# Altium schematic sheet head(mehdi).SchDoc
size A2
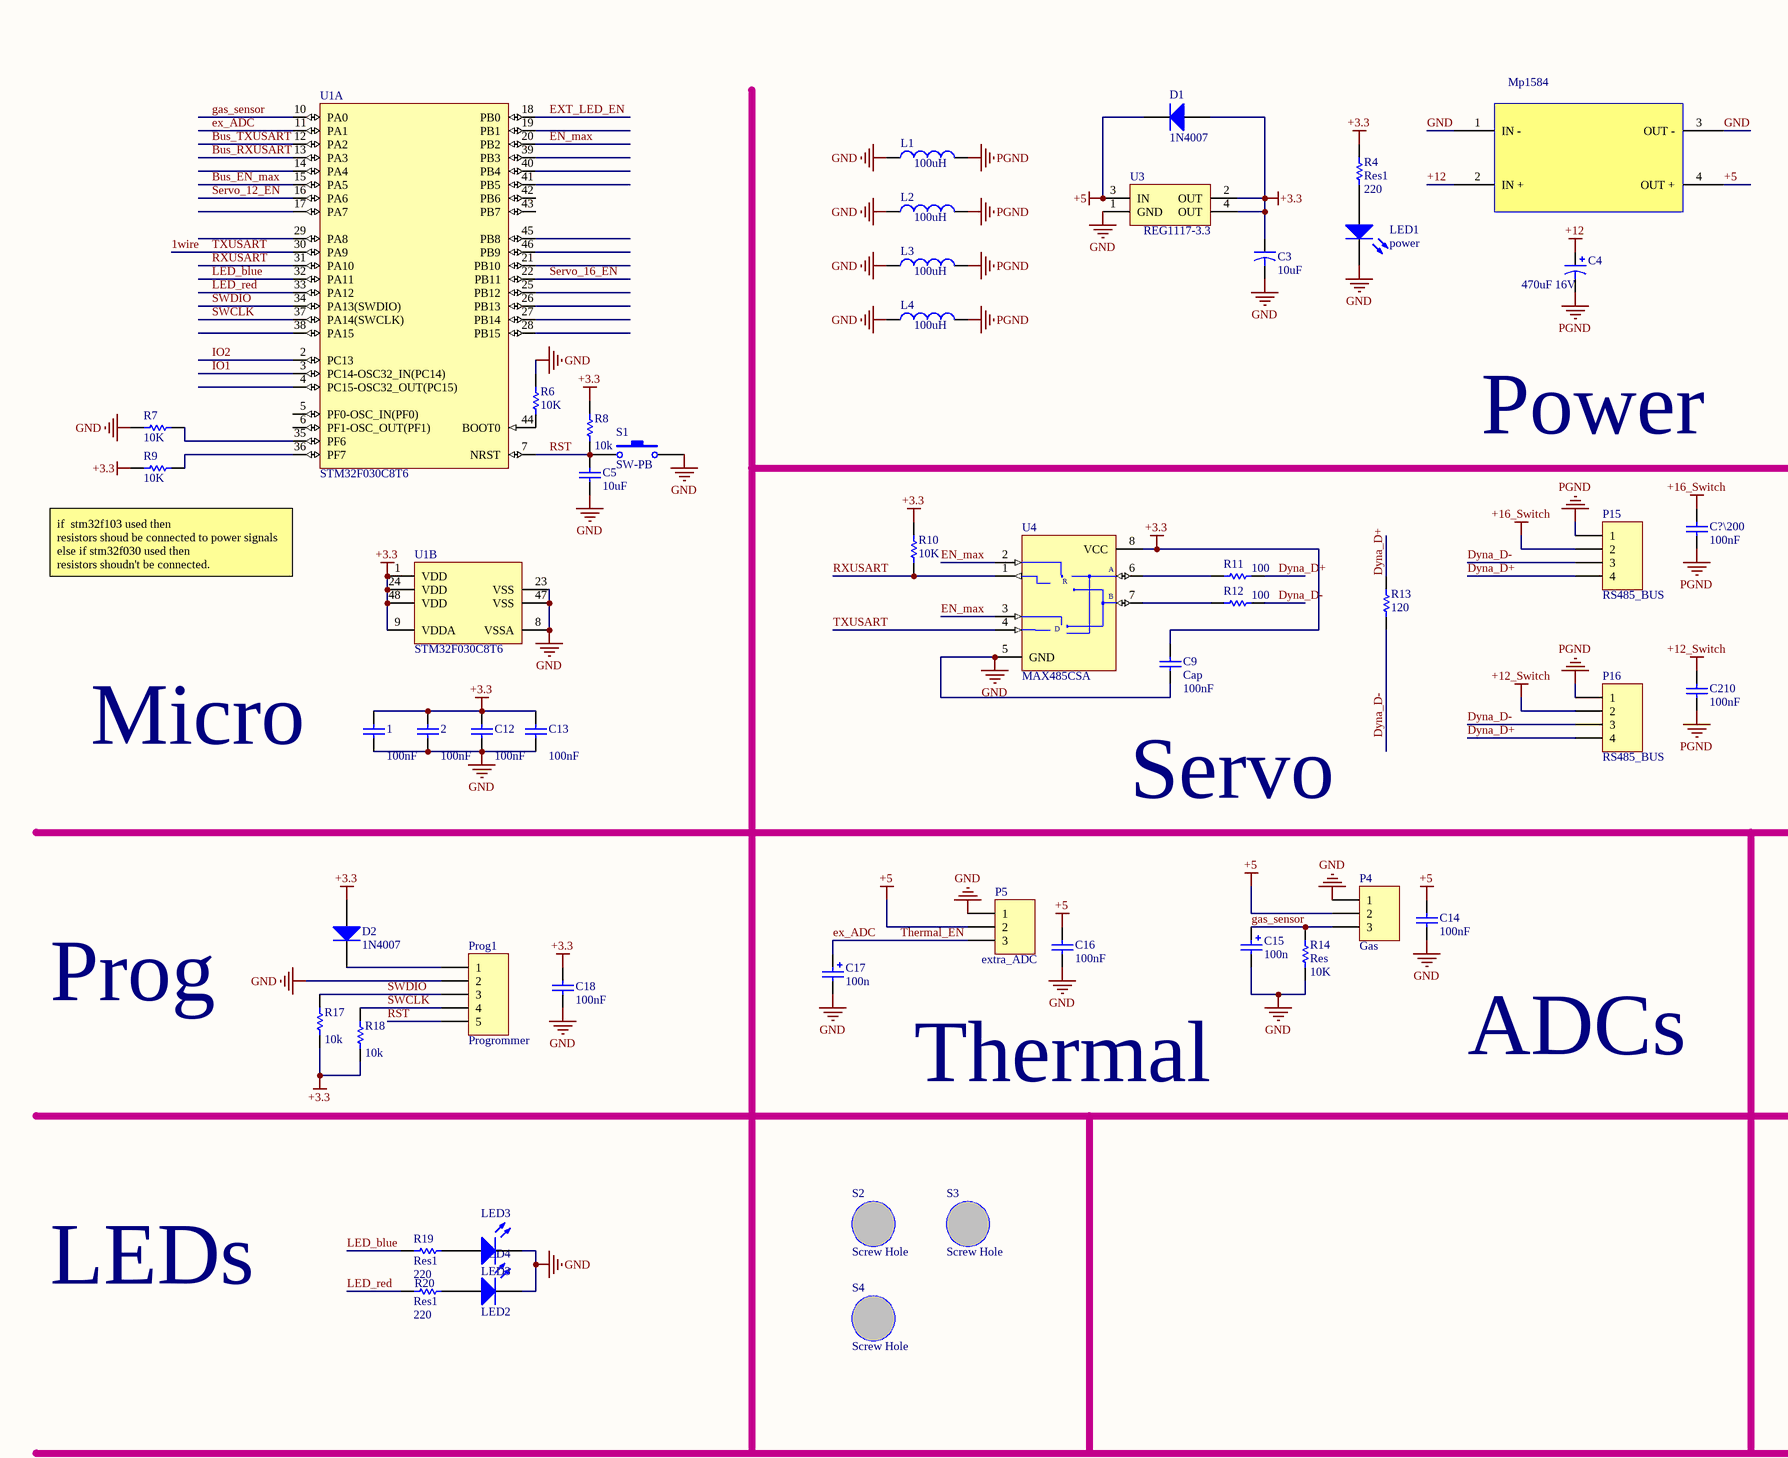
[diagram p0: head(mehdi).SchDoc, left]
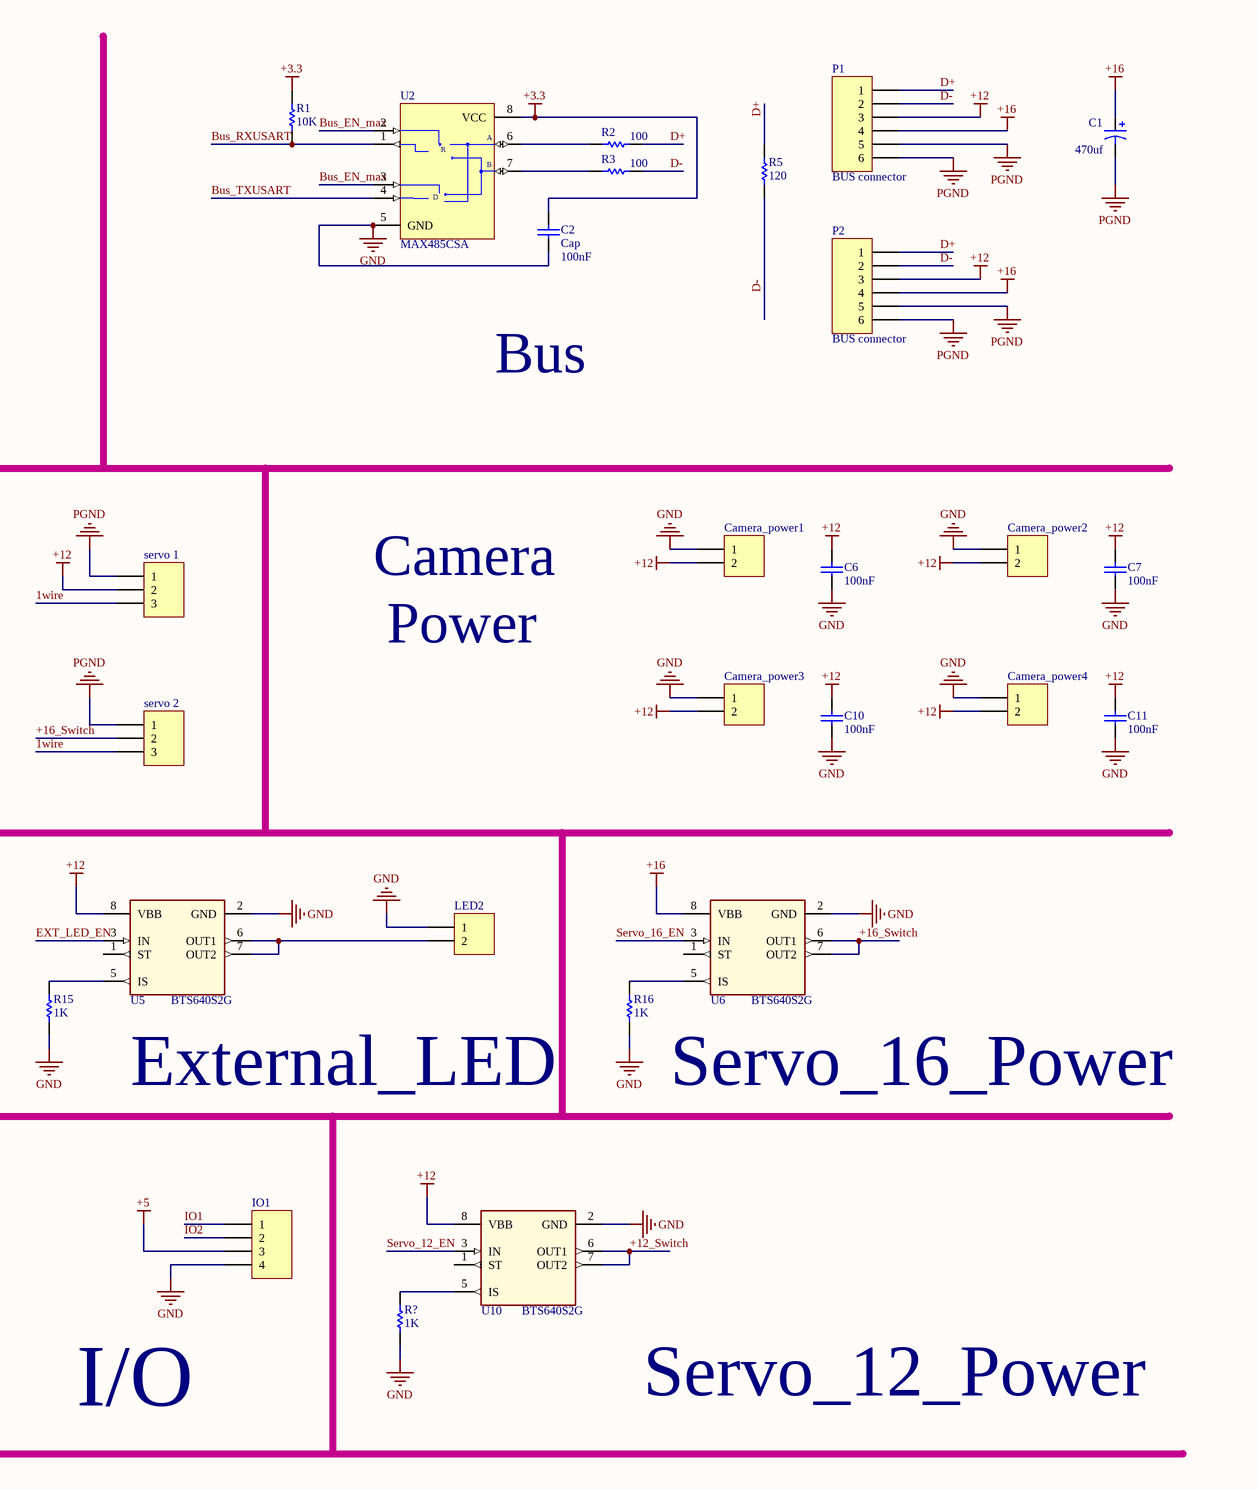
[diagram p1: head(mehdi).SchDoc, right]

## Parts
1  value 100nF  [j1-0603]
2  value 100nF  [j1-0603]
C1  value 470uf  [CAP 470uf sleep smd]  (hidden comment: Cap Pol1)
C2  Cap  value 100nF  [j1-0603]
C3  value 10uF  [0805]  (hidden comment: Cap_El)
C4  value 470uF 16V  [CAP 470uf sleep smd]  (hidden comment: Cap Pol1)
C5  10uF  [2012[0805]]
C6  100nF  [J1-0603]
C7  100nF  [J1-0603]
C9  Cap  value 100nF  [j1-0603]
C10  100nF  [J1-0603]
C11  100nF  [J1-0603]
C12  value 100nF  [j1-0603]
C13  value 100nF  [j1-0603]
C14  100nF  [J1-0603]
C15  value 100n  [j1-0603]
C16  100nF  [J1-0603]
C17  value 100n  [j1-0603]
C18  value 100nF  [j1-0603]
C210  100nF  [J1-0603]
C?\200  100nF  [J1-0603]
Camera_power1  Header 2  [jp circular 2]  (value not drawn)
Camera_power2  Header 2  [jp circular 2]  (value not drawn)
Camera_power3  Header 2  [jp circular 2]  (value not drawn)
Camera_power4  Header 2  [jp circular 2]  (value not drawn)
D1  1N4007  [US1M]
D2  1N4007  [US1M]
IO1  (no value)  [HDR1X4]
L1  value 100uH  [2012[0805]]
L2  value 100uH  [2012[0805]]
L3  value 100uH  [2012[0805]]
L4  value 100uH  [2012[0805]]
LED1  power  [3518]
LED2  (no value)  [jp circular 2]
LED3  LED3  [3518]
LED4  LED2  [3518]
Mp1  Mp1584  [mp1584-1.8]
P1  BUS connector  [CON6-TIWAN]
P2  BUS connector  [con6-tiwan]
P4  Gas  [jp circular 3]
P5  extra_ADC  [jp circular 3]
P15  RS485_BUS  [jp circular 4]
P16  RS485_BUS  [jp circular 4]
Prog1  Progrommer  [HDR1x5]
R1  value 10K  [j1-0603]  (hidden comment: Res1)
R2  value 100  [j1-0603]  (hidden comment: Res1)
R3  value 100  [j1-0603]  (hidden comment: Res1)
R4  Res1  value 220  [j1-0603]
R5  value 120  [j1-0603]  (hidden comment: Res1)
R6  10K  [J1-0603]
R7  10K  [J1-0603]
R8  value 10k  [J1-0603]
R9  10K  [J1-0603]
R10  value 10K  [j1-0603]  (hidden comment: Res1)
R11  value 100  [j1-0603]  (hidden comment: Res1)
R12  value 100  [j1-0603]  (hidden comment: Res1)
R13  value 120  [j1-0603]  (hidden comment: Res1)
R14  Res  value 10K  [j1-0603]
R15  value 1K  [j1-0603]  (hidden comment: Res1)
R16  value 1K  [j1-0603]  (hidden comment: Res1)
R17  value 10k  [J1-0603]
R18  value 10k  [J1-0603]
R19  Res1  value 220  [j1-0603]
R20  Res1  value 220  [j1-0603]
R?  value 1K  [j1-0603]  (hidden comment: Res1)
S1  SW-PB  [sw-pb-4p]
S2  Screw Hole  [Screw Holw 3-6 mm]
S3  Screw Hole  [Screw Holw 3-6 mm]
S4  Screw Hole  [Screw Holw 3-6 mm]
servo_1  (no value)  [jp circular 3]
servo_2  (no value)  [jp circular 3]
U1  STM32F030C8T6  [STM-LQFP48_N]  (parts A,B of 2)
U2  MAX485CSA  [NSO8_N]
U3  REG1117-3.3  [SOT223]
U4  MAX485CSA  [NSO8_N]
U5  BTS640S2G  [TO127P1490X440-8_7N]
U6  BTS640S2G  [TO127P1490X440-8_7N]
U10  BTS640S2G  [TO127P1490X440-8_7N]

## Nets
+3.3: 1.2 2.2 C2.2 C3.1 C9.2 C12.2 C13.2 C18.2 D1.1(A) D2.1(A) R1.1 R4.1 R8.1 R9.1 R10.1 R17.2 R18.2 U1.1(VDD) U1.9(VDDA) U1.24(VDD) U1.48(VDD) U2.8(VCC) U3.2(OUT) U3.4(OUT) U4.8(VCC)
+5: C14.2 C16.2 D1.2(K) IO1.3 Mp1.4(OUT_+) P4.2 P5.2 U3.3(IN)
+12: C4.1 C6.2 C7.2 C10.2 C11.2 Camera_power1.2 Camera_power2.2 Camera_power3.2 Camera_power4.2 Mp1.2(IN_+) P1.3 P2.3 servo_1.2 U5.8(VBB) U10.8(VBB)
+12_Switch: C210.2 P16.2 U10.6(OUT1) U10.7(OUT2)
+16: C1.1 P1.4 P2.4 U6.8(VBB)
+16_Switch: C?\200.2 P15.2 servo_2.2 U6.6(OUT1) U6.7(OUT2)
GND: 1.1 2.1 C2.1 C3.2 C5.2 C6.1 C7.1 C9.1 C10.1 C11.1 C12.1 C13.1 C14.1 C15.2 C16.1 C17.2 C18.1 Camera_power1.1 Camera_power2.1 Camera_power3.1 Camera_power4.1 IO1.4 L1.1 L2.1 L3.1 L4.1 LED1.2(K) LED2.1 LED3.2(K) LED4.2(K) Mp1.1(IN_-) Mp1.3(OUT_-) P4.1 P5.1 Prog1.2 R6.2 R7.2 R14.1 R15.1 R16.1 R?.1 S1.2 U1.8(VSSA) U1.23(VSS) U1.47(VSS) U2.5(GND) U3.1(GND) U4.5(GND) U5.2(GND) U6.2(GND) U10.2(GND)
PGND: C1.2 C4.2 C210.1 C?\200.1 L1.2 L2.2 L3.2 L4.2 P1.5 P1.6 P2.5 P2.6 P15.1 P16.1 servo_1.1 servo_2.1
1wire: servo_1.3 servo_2.3 U1.30(PA9) U4.4(DI)  [also labelled TXUSART]
Bus_EN_max: U1.15(PA5) U2.2(~{RE}) U2.3(DE)
Bus_RXUSART: R1.2 U1.13(PA3) U2.1(RO)
Bus_TXUSART: U1.12(PA2) U2.4(DI)
D+: P1.1 P2.1 R2.2 R5.1
D-: P1.2 P2.2 R3.2 R5.2
Dyna_D+: P15.4 P16.4 R11.2 R13.1
Dyna_D-: P15.3 P16.3 R12.2 R13.2
EN_max: U1.20(PB2) U4.2(~{RE}) U4.3(DE)
ex_ADC: C17.1 P5.3 U1.11(PA1)  [also labelled Thermal_EN]
EXT_LED_EN: U1.18(PB0) U5.3(IN)
gas_sensor: C15.1 P4.3 R14.2 U1.10(PA0)
IO1: IO1.1 U1.3(PC14-OSC32_IN(PC14))
IO2: IO1.2 U1.2(PC13)
LED_blue: R19.1 U1.32(PA11)
LED_red: R20.1 U1.33(PA12)
RST: C5.1 Prog1.5 R8.2 S1.1 U1.7(NRST)
RXUSART: R10.2 U1.31(PA10) U4.1(RO)
Servo_12_EN: U1.16(PA6) U10.3(IN)
Servo_16_EN: U1.22(PB11) U6.3(IN)
SWCLK: Prog1.4 R18.1 U1.37(PA14(SWCLK))
SWDIO: Prog1.3 R17.1 U1.34(PA13(SWDIO))
NetD2_2: D2.2(K) Prog1.1
NetLED1_1: LED1.1(A) R4.2
NetLED2_2: LED2.2 U5.6(OUT1) U5.7(OUT2)
NetLED3_1: LED3.1(A) R19.2
NetLED4_1: LED4.1(A) R20.2
NetR2_1: R2.1 U2.6(A)
NetR3_1: R3.1 U2.7(B)
NetR6_1: R6.1 U1.44(BOOT0)
NetR7_1: R7.1 U1.35(PF6)
NetR9_2: R9.2 U1.36(PF7)
NetR11_1: R11.1 U4.6(A)
NetR12_1: R12.1 U4.7(B)
NetR15_2: R15.2 U5.5(IS)
NetR16_2: R16.2 U6.5(IS)
NetR?_2: R?.2 U10.5(IS)

Not connected (* = marked no-connect by the designer): U1 4(PC15-OSC32_OUT(PC15)) 5(PF0-OSC_IN(PF0)) 6(PF1-OSC_OUT(PF1)) 14(PA4) 17(PA7) 19(PB1) 21(PB10) 25(PB12) 26(PB13) 27(PB14) 28(PB15) 29(PA8) 38(PA15) 39(PB3) 40(PB4) 41(PB5) 42(PB6) 43(PB7) 45(PB8) 46(PB9); U5 1(ST); U6 1(ST); U10 1(ST)

## Notes on the sheet
- Bus
- Power
- if  stm32f103 used then
  resistors shoud be connected to power signals
  else if stm32f030 used then
  resistors shoudn't be connected.
- Camera
- Micro
- Servo
- Prog
- Thermal
- ADCs
- External_LED
- Servo_16_Power
- LEDs
- I/O
- Servo_12_Power
- (in symbol MAX485CSA) R; D

## Library data of the parts
1 2 C12 C13 C18 = Cap: Capacitor; Manufacturer: Generic Components; Class: Passive; Published: 08/06/2000; Publisher: Altium Hobart Technology Centre; SubClass: Capacitor
C1 = Cap Pol1: Polarized Capacitor (Radial); Published: 8-Jun-2000; LatestRevisionDate: 17-Jul-2002; LatestRevisionNote: Re-released for DXP Platform.; PackageReference: RB7.6-15; Publisher: Altium Limited
C2 C6 C7 C9-C11 C14 C16 C210 C?\200 = Cap: Capacitor; Published: 8-Jun-2000; LatestRevisionDate: 17-Jul-2002; LatestRevisionNote: Re-released for DXP Platform.; PackageReference: RAD-0.3; Publisher: Altium Limited
  C6 C7 C10 C11 C14 C16 C210 C?\200: Value: 100nF
C3 = Cap_El: Capacitor; Published: 23-Sep-2002; PackageReference: CAPR5-4X5; Publisher: Altium Limited
C4 = Cap Pol1: Polarized Capacitor (Radial); pin to pad: 1>2 2>1; Published: 8-Jun-2000; LatestRevisionDate: 17-Jul-2002; LatestRevisionNote: Re-released for DXP Platform.; PackageReference: RB7.6-15; Publisher: Altium Limited
C5 = Cap: Capacitor; Value: 100nF; Published: 8-Jun-2000; LatestRevisionDate: 17-Jul-2002; LatestRevisionNote: Re-released for DXP Platform.; PackageReference: RAD-0.3; Publisher: Altium Limited
C15 C17 = Cap Pol1: Polarized Capacitor (Radial); Manufacturer: Generic Components; Class: Passive; Published: 08/06/2000; Publisher: Altium Hobart Technology Centre; SubClass: Capacitor
Camera_power1-Camera_power4 LED2 = Header 2: Header, 2-Pin; Publisher: Altium Limited
  Camera_power1-Camera_power4: Revision: 17-Jul-2002: Re-released for DXP Platform.
  LED2: LatestRevisionDate: 17-Jul-2002; LatestRevisionNote: Re-released for DXP Platform.
D1 D2 = Diode: 1 Amp General Purpose Rectifier; Revision 1: 11-Jul-2000: SIM Model Added.; Revision 2: 17-Jul-2002: Re-released for DXP Platform.; Package Information: Latest Revision: Aug-1999; Code - JEDEC: DO-204-AL; Published: 8-Jun-2000; Datasheet: Latest Revision: 1998; Package Reference: DO-41; Publisher: Altium Limited
IO1 P15 P16 = Header 4: Header, 4-Pin; LatestRevisionDate: 17-Jul-2002; LatestRevisionNote: Re-released for DXP Platform.; Publisher: Altium Limited
L1-L4 = Inductor: Manufacturer: Generic Components; Class: Passive; Published: 08/06/2000; Publisher: Altium Hobart Technology Centre; SubClass: Inductor
LED1 LED3 LED4 = LED3: Typical BLUE SiC LED; pin to pad: 1>2 2>1; Published: 8-Jun-2000; LatestRevisionDate: 17-Dec-2003; LatestRevisionNote: PCB Footprint replaced.; DatasheetDocument: 16-Apr-2002; PackageDocument: 16-Apr-2002; PackageReference: 3.5X2.8X1.9; Publisher: Altium Limited
P1 P2 = Header 6: Header, 6-Pin; LatestRevisionDate: 17-Jul-2002; LatestRevisionNote: Re-released for DXP Platform.; Publisher: Altium Limited
P4 P5 servo_1 servo_2 = Header 3: Header, 3-Pin; LatestRevisionDate: 17-Jul-2002; LatestRevisionNote: Re-released for DXP Platform.; Publisher: Altium Limited
Prog1 = Header 5: Header, 5-Pin; LatestRevisionDate: 17-Jul-2002; LatestRevisionNote: Re-released for DXP Platform.; Publisher: Altium Limited
R1-R5 R10-R13 R15 R16 R19 R20 R? = Res1: Resistor; Published: 8-Jun-2000; LatestRevisionDate: 17-Jul-2002; LatestRevisionNote: Re-released for DXP Platform.; PackageReference: AXIAL-0.3; Publisher: Altium Limited
R6 R7 R9 = Res1: Resistor; Value: 1K; Published: 8-Jun-2000; LatestRevisionDate: 17-Jul-2002; LatestRevisionNote: Re-released for DXP Platform.; PackageReference: AXIAL-0.3; Publisher: Altium Limited
R8 R14 R17 R18 = Res: Semiconductor Resistor; Published: 8-Jun-2000; LatestRevisionDate: 17-Jul-2002; LatestRevisionNote: Re-released for DXP Platform.; PackageReference: AXIAL-0.5; Publisher: Altium Limited
S1 = SW-PB: Switch; Published: 24-Mar-1999; LatestRevisionDate: 17-Jul-2002; LatestRevisionNote: Re-released for DXP Platform.; PackageReference: SPST-2; Publisher: Altium Limited
U1 = STM32F030C8T6: ARM Cortex-M0 32-bit MCU, 64 KB Flash, 8 KB Internal RAM, 39 I/Os, 48-pin LQFP, -40 to 85 degC, Tray; FLASH Size (Prog) (kB): 64; I/Os (High Current): 39; Internal RAM Size (kB): 8; Operating Frequency(F) (Processor speed) (MHz): 48; Supply Voltage(Vcc) min (V): 2.4; DatasheetVersion: Rev. 1; PackageVersion: Rev. 6, 06/2013; PackageReference: LQFP48; PackageDescription: 48-Pin Low Profile Quad Flat Package, 7 x 7 mm Body, 0.5 mm Pitch; Supplier 1: Digi-Key; Supplier Part Number 1: 497-14043-ND; Supplier 2: Newark; Supplier Part Number 2: 06X3647; Supplier 3: Mouser; Supplier Part Number 3: 511-STM32F030C8T6; Core: ARM Cortex-M0; Packing: Tray; Mounting Technology: Surface Mount; PartNumber: STM32F030C8T6; ComponentLink1Description: Manufacturer URL; ComponentLink1URL: http://www.st.com/web/en/home.html; ComponentLink2Description: Datasheet; ComponentLink2URL: http://www.st.com/st-web-ui/static/active/en/resource/technical/document/datasheet/DM00088500.pdf; ComponentLink3Description: Package Specification; ComponentLink3URL: http://www.st.com/st-web-ui/static/active/en/resource/technical/document/datasheet/DM00058181.pdf
U2 U4 = MAX485CSA: Low-Power, Slew-Rate-Limited RS-485/RS-422 Transceiver; Published: 16-Jan-2001; LatestRevisionDate: 13-Apr-2006; LatestRevisionNote: IPC-7351 Footprint Added.; DatasheetVersion: Feb-1996; PackageReference: NSO8; Publisher: Altium Limited; PackageDescription: 8-Pin Small Outline Integrated Circuit 1.27 mm Pitch; Code_JEDEC: MS-012-AA; Code_IPC: SOIC127P600-8; ComponentLink1Description: Manufacturer Link; ComponentLink1URL: http://www.maxim-ic.com/; ComponentLink2Description: Datasheet; ComponentLink2URL: http://pdfserv.maxim-ic.com/en/ds/MAX1487-MAX491.pdf
U3 = REG1117-3.3: 800mA and 1A Low Dropout Positive Regulator 2.85V, 3.3V, 5V, and Adjustable; Published: 8-Jun-2000; LatestRevisionDate: 17-Jul-2002; LatestRevisionNote: Re-released for DXP Platform.; DatasheetVersion: Sep-1997; PackageVersion: revC; PackageReference: ZZ311; Publisher: Altium Limited; PackageDescription: SOT-223/SC-73; 4 Leads; Body 6.7 x 7.3 mm, inc. leads (LxW max); ComponentLink1Description: Manufacturer Link; ComponentLink1URL: http://www.ti.com/; ComponentLink2Description: Datasheet; ComponentLink2URL: http://www-s.ti.com/sc/ds/REG1117.pdf
U5 U6 U10 = BTS640S2G: Smart Sense High-Side Power Switch, VBB 43V, R(ON) 30mOhm; Manufacturer: Infineon Technologies; ManufacturerPartNumber: BTS640S2G; PackageReference: PG-TO263-7-2